# Altium schematic sheet USB.SchDoc
size A4; Author: Michał Kowalik; CompanyName: AGH Racing; DocumentNumber: 6; Revision: 2.1; SheetNumber: 6; SheetTotal: 11; CarNumber: 5; ProjectName: Project Name
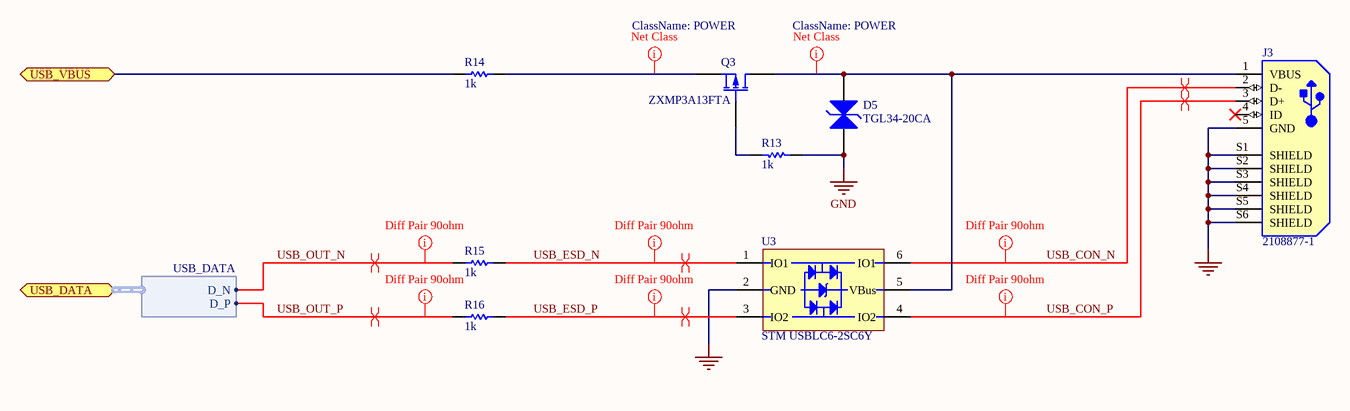
[diagram p0: USB.SchDoc]

## Parts
D5  TGL34-20CA  [DIO_MELF_IPC_MD]
J3  2108877-1  [MicroUSB_2108877-1]
Q3  ZXMP3A13FTA  [SOT23_IPC_MD]
R13  value 1k  [RES_0603_IPC_MD]  (hidden comment: Res)
R14  value 1k  [RES_0603_IPC_MD]  (hidden comment: Res)
R15  value 1k  [RES_0603_IPC_MD]  (hidden comment: Res)
R16  value 1k  [RES_0603_IPC_MD]  (hidden comment: Res)
U3  STM USBLC6-2SC6Y  [SOT23-6L_IPC_MD]

## Ports
USB_DATA (bidir, harness USB_DATA), USB_VBUS (bidir)

## Harnesses
USB_DATA: D_N, D_P

## Nets
GND: D5.1(IN1) J3.5(GND) J3.S1(SHIELD) J3.S2(SHIELD) J3.S3(SHIELD) J3.S4(SHIELD) J3.S5(SHIELD) J3.S6(SHIELD) R13.2 U3.2(GND)
USB_CON_N: J3.2(D-) U3.6(IO1)
USB_CON_P: J3.3(D+) U3.4(IO2)
USB_ESD_N: R15.2 U3.1(IO1)
USB_ESD_P: R16.2 U3.3(IO2)
USB_OUT_N: R15.1 ; port USB_DATA.D_N
USB_OUT_P: R16.1 ; port USB_DATA.D_P
USB_VBUS: R14.1 ; port USB_VBUS
NetD5_2: D5.2(IN2) J3.1(VBUS) Q3.3(D) U3.5(VBus)
NetQ3_1: Q3.1(G) R13.1
NetQ3_2: Q3.2(S) R14.2

Not connected (* = marked no-connect by the designer): J3 4(ID)*

## Layout directives
mark named Diff Pair 90ohm: USB_CON_N, USB_CON_P, USB_ESD_N, USB_ESD_P, USB_OUT_N, USB_OUT_P
differential pair: USB_CON_N, USB_CON_P, USB_ESD_N, USB_ESD_P
net class POWER: NetD5_2, NetQ3_2
differential pair; differential pair class USB_DATA: USB_OUT_N, USB_OUT_P

## Notes on the sheet
- Confidential / Not for distribution !
- Project name:
- Document name:
- Sheet:
- Car No.
- of
- Designer Name:
- Date/Time:
- Revision:

## Library data of the parts
D5 = TGL34-20CA: Transil
J3 = MicroUSB 2108877-1: TE Connectivity
Q3 = ZXMP3A13FTA: P-mosfet
R13-R16 = Res: Resistor
U3 = USBLC6-2SC6Y: Automotive very low capacitance ESD protection (USB)